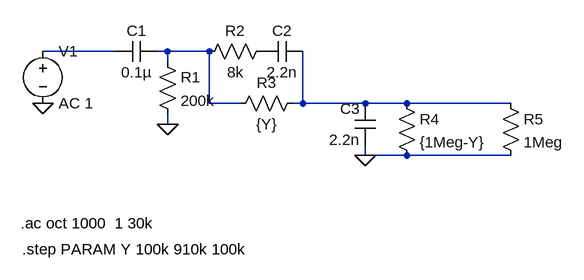
[diagram p0: schematic tonecontrol.asc]
tonecontrol.asc, the LTspice schematic file:
Version 4
SHEET 1 880 680
WIRE 64 112 -48 112
WIRE 144 112 128 112
WIRE 208 112 144 112
WIRE 144 128 144 112
WIRE 208 192 208 112
WIRE 256 192 208 192
WIRE 352 192 352 112
WIRE 352 192 336 192
WIRE 448 192 352 192
WIRE 512 192 448 192
WIRE 672 192 512 192
WIRE 144 224 144 208
WIRE 448 272 448 256
WIRE 512 272 448 272
WIRE 672 272 512 272
FLAG -48 192 0
FLAG 144 224 0
FLAG 448 272 0
SYMBOL voltage -48 96 R0
SYMATTR InstName V1
SYMATTR Value AC 1
SYMBOL cap 128 96 R90
WINDOW 0 0 32 VBottom 2
WINDOW 3 32 32 VTop 2
SYMATTR InstName C1
SYMATTR Value 0.1µ
SYMBOL res 128 112 R0
SYMATTR InstName R1
SYMATTR Value 200k
SYMBOL res 304 96 R90
WINDOW 0 0 56 VBottom 2
WINDOW 3 32 56 VTop 2
SYMATTR InstName R2
SYMATTR Value 8k
SYMBOL res 352 176 R90
WINDOW 0 0 56 VBottom 2
WINDOW 3 32 56 VTop 2
SYMATTR InstName R3
SYMATTR Value {Y}
SYMBOL cap 352 96 R90
WINDOW 0 0 32 VBottom 2
WINDOW 3 32 32 VTop 2
SYMATTR InstName C2
SYMATTR Value 2.2n
SYMBOL cap 464 256 R180
WINDOW 0 24 56 Left 2
WINDOW 3 24 8 Left 2
SYMATTR InstName C3
SYMATTR Value 2.2n
SYMBOL res 496 176 R0
SYMATTR InstName R4
SYMATTR Value {1Meg-Y}
SYMBOL res 656 176 R0
SYMATTR InstName R5
SYMATTR Value 1Meg
TEXT -82 376 Left 2 !.ac oct 1000  1 30k
TEXT -80 416 Left 2 !.step PARAM Y 100k 910k 100k

The netlist it stands for:
* tonecontrol.asc
V1 N001 0 AC 1
C1 N002 N001 0.1µ
R1 N002 0 200k
R2 P001 N002 8k
R3 N003 N002 {Y}
C2 N003 P001 2.2n
C3 0 N003 2.2n
R4 N003 0 {1Meg-Y}
R5 N003 0 1Meg
.ac oct 1000  1 30k
.step PARAM Y 100k 910k 100k
.backanno
.end